# EAGLE design hih8000 (EAGLE 7.6.0)
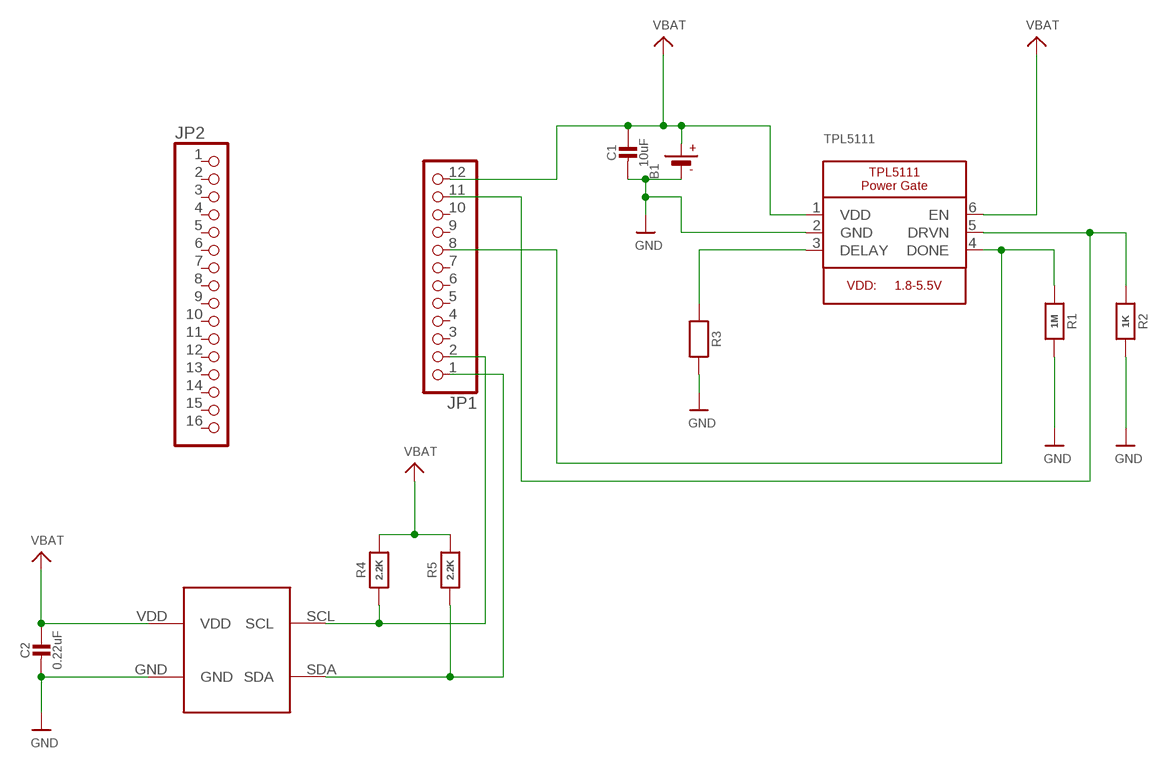
[diagram p0: schematic, sheet 1]

## Parts
B1  BATTERY  [JSTPH2]
C1  10uF  CAP_CERAMIC0805-NOOUTLINE  [0805-NO]
C2  0.22uF  CAP_CERAMIC0805-NOOUTLINE  [0805-NO]
JP1  HEADER-1X12  [1X12_ROUND]
JP2  HEADER-1X16ROUND  [1X16_ROUND]
R1  1M  RESISTOR0805_NOOUTLINE  [0805-NO]
R2  1K  RESISTOR0805_NOOUTLINE  [0805-NO]
R3  RESISTOR0805_NOOUTLINE  [0805-NO]
R4  2.2K  RESISTOR0805_NOOUTLINE  [0805-NO]
R5  2.2K  RESISTOR0805_NOOUTLINE  [0805-NO]
TPL5111  TPL5111  [SOT23-6]
U$7  HIH8000_DEV  [HIH8000]

## Nets
GND: B1.1(-) C1.2 C2.2 R1.2 R2.2 R3.2 TPL5111.2(GND) U$7.GND
N$1: JP1.11 R2.1 TPL5111.5(DRVN)
N$2: JP1.8 R1.1 TPL5111.4(DONE)
N$3: R3.1 TPL5111.3(DELAY)
N$4: JP1.2 R4.1 U$7.SCL
N$5: JP1.1 R5.1 U$7.SDA
VBAT: B1.2(+) C1.1 C2.1 JP1.12 R4.2 R5.2 TPL5111.1(VDD) TPL5111.6(EN) U$7.VDD
Unconnected: JP1.3 JP1.4 JP1.5 JP1.6 JP1.7 JP1.9 JP1.10 JP2.1 JP2.2 JP2.3 JP2.4 JP2.5 JP2.6 JP2.7 JP2.8 JP2.9 JP2.10 JP2.11 JP2.12 JP2.13 JP2.14 JP2.15 JP2.16

## Library data of the parts
B1 = microbuilder:BATTERY: CR1220 SMT - Digikey: 3001K-ND CD2032 BAT-HLD-001 - Digikey: BAT-HLD-001-ND
C1 C2 = microbuilder:CAP_CERAMIC: Ceramic Capacitors For new designs, use the packages preceded by an '_' character since they are more reliable: The following footprints should be used on most boards: _0402 - Standard footprint for regular board layouts _0603 - Standard footprint for regular board layouts _0805 - Standard footprint for regular board layouts _1206 - Standard footprint for regular board layouts For extremely tight-pitch boards where space is at a premium, the following 'micro-pitch' footprints can be used (smaller pads, no silkscreen outline, etc.): _0402MP - Micro-pitch footprint for very dense/compact boards _0603MP - Micro-pitch footprint for very dense/compact boards _0805MP - Micro-pitch footprint for very dense/compact boards _1206MP - Micro-pitch footprint for very dense/compact boards
JP1 = microbuilder:HEADER-1X12
JP2 = microbuilder:HEADER-1X16: PIN HEADER
R1-R5 = microbuilder:RESISTOR: Resistors For new designs, use the packages preceded by an '_' character since they are more reliable: The following footprints should be used on most boards: _0402 - Standard footprint for regular board layouts _0603 - Standard footprint for regular board layouts _0805 - Standard footprint for regular board layouts _1206 - Standard footprint for regular board layouts For extremely tight-pitch boards where space is at a premium, the following 'micro-pitch' footprints can be used (smaller pads, no silkscreen outline, etc.): _0402MP - Micro-pitch footprint for very dense/compact boards _0603MP - Micro-pitch footprint for very dense/compact boards _0805MP - Micro-pitch footprint for very dense/compact boards _1206MP - Micro-pitch footprint for very dense/compact boards
TPL5111 = microbuilder:TPL5111: TPL5111 Timer Based Power Gate Selectable Time Intervals: 100 ms to 7200 s Current Consumption at 2.5 V: 35 nA (typical) Supply Voltage Range: 1.8 V to 5.5 V
U$7 = cvr_HIH8120-021-001:HIH8000_DEV

## Net classes
0 default: width 0.025 mm, drill 0.025 mm, clearance 0.025 mm

## Board
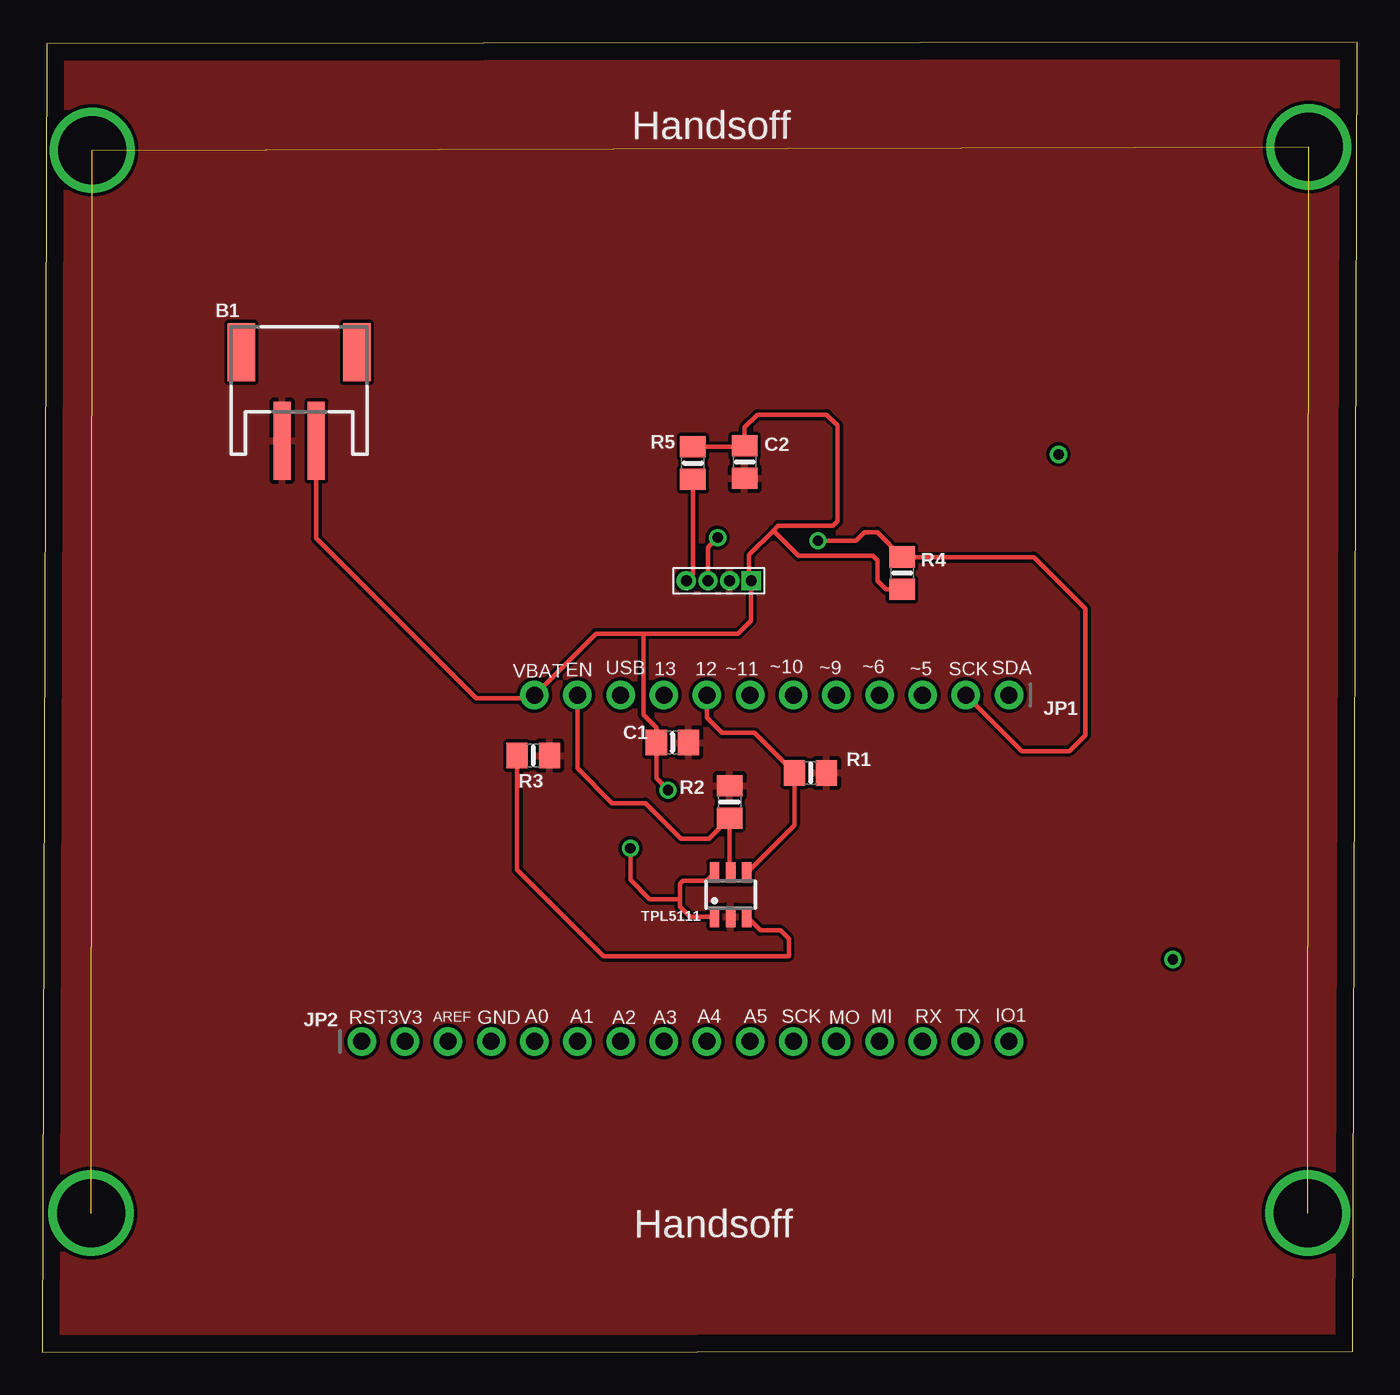
[diagram p1: board, top side]
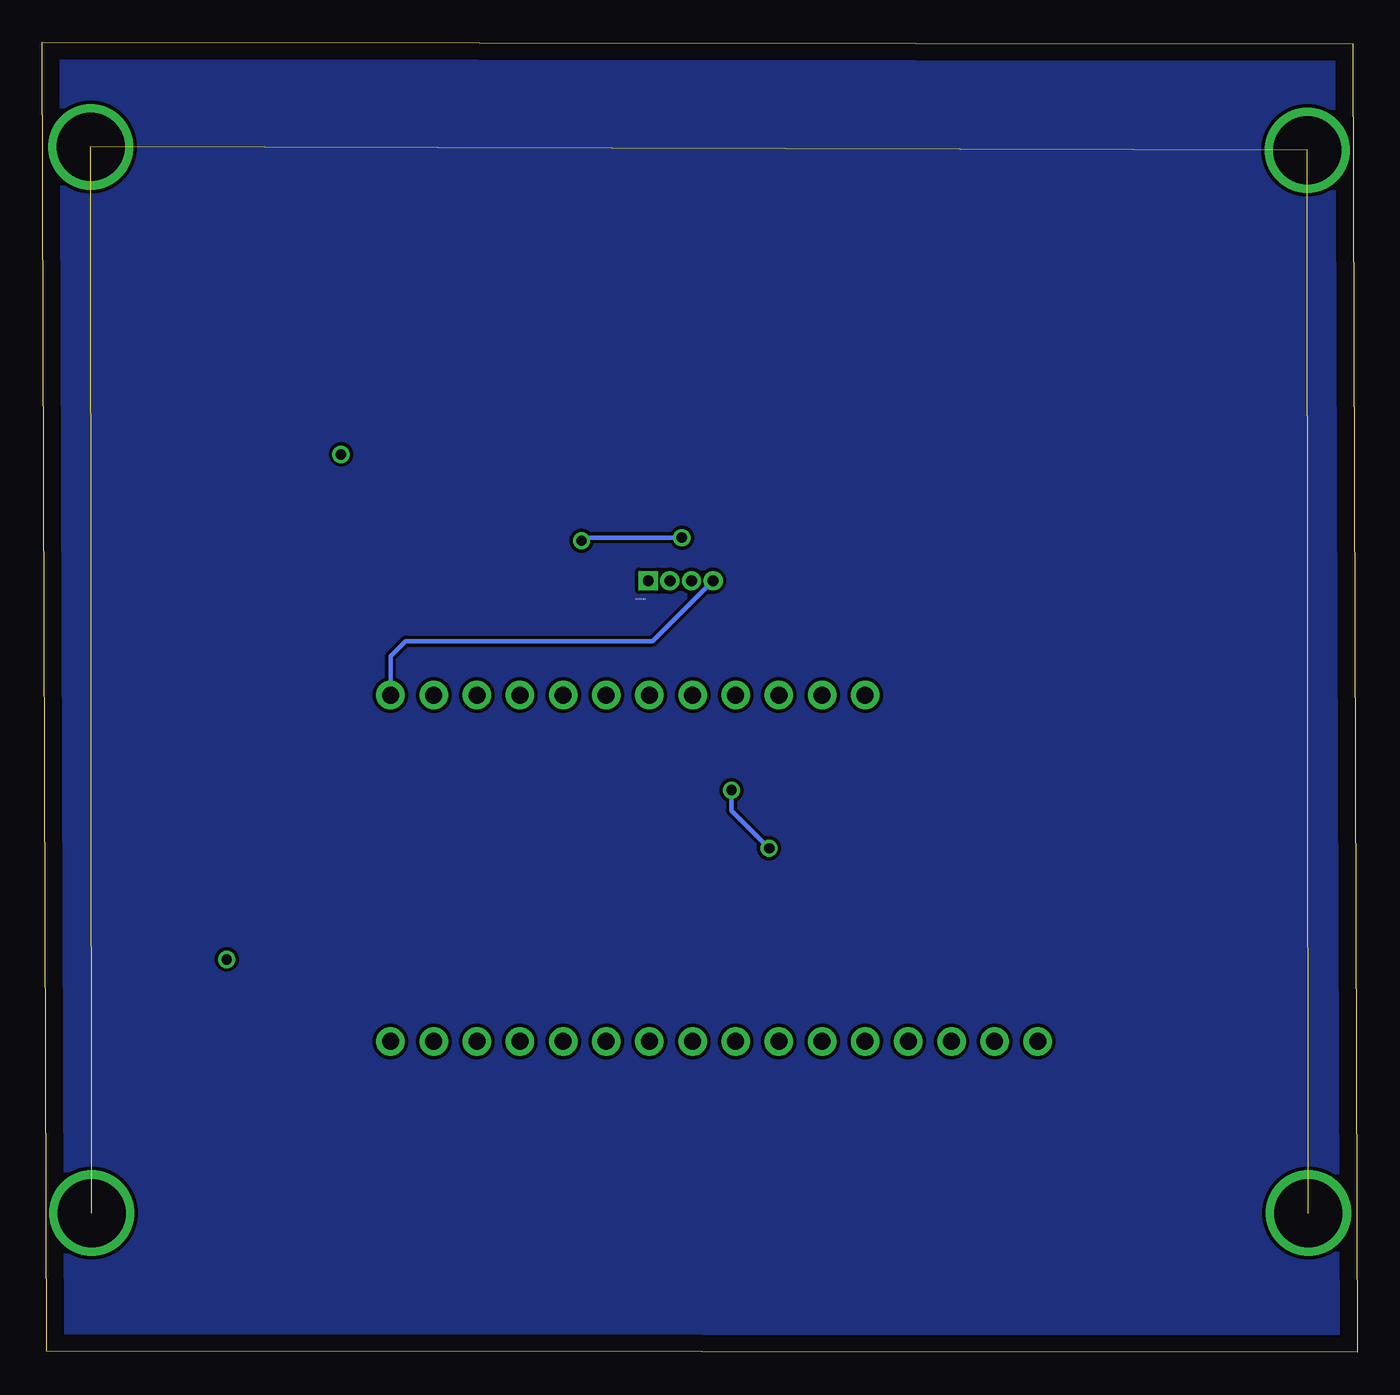
[diagram p2: board, bottom side, seen from below]

Size 77.39 x 77.08 mm. Coordinates in mm from the lower left corner, seen from the top.
Outline: 0,0 77.13,0.06 77.39,77.08 0.25,77.01 0,0
Copper layers (1*16): Top 0.035mm / dielectric 1.5mm / Bottom 0.035mm
Design rules "default": minimum track width 10mil, minimum drill 24mil, track to track 8mil, track to pad 8mil, pad to pad 8mil, via to via 8mil, smd to smd 8mil, copper to edge 40mil, drill to drill 8mil, minimum pad ring 10mil, minimum via ring 8mil, stop-mask expansion 4mil, vias tented up to drill 0mil, thermal gap 10mil

### Footprints (pad centres in the part's own frame; a part is rotated, then mirrored left to right if it is on the bottom)
JSTPH2 = smd 1 x 4.6: 1 -1,-3.7; 2 1,-3.7 | smd 1.6 x 3.4: NC1 -3.4,1.5; NC2 3.4,1.5
0805-NO = smd 1.24 x 1.5: 1 -0.95,0; 2 0.95,0
1X12_ROUND = drill 1 pad 1.676: 1 -13.97,0; 2 -11.43,0; 3 -8.89,0; 4 -6.35,0; 5 -3.81,0; 6 -1.27,0; 7 1.27,0; 8 3.81,0; 9 6.35,0; 10 8.89,0; 11 11.43,0; 12 13.97,0
1X16_ROUND = drill 1 pad 1.676: 1 -19.05,0; 2 -16.51,0; 3 -13.97,0; 4 -11.43,0; 5 -8.89,0; 6 -6.35,0; 7 -3.81,0; 8 -1.27,0; 9 1.27,0; 10 3.81,0; 11 6.35,0; 12 8.89,0; 13 11.43,0; 14 13.97,0; 15 16.51,0; 16 19.05,0
SOT23-6 = smd 0.55 x 1.2: 1 -0.95,-1.3; 2 0,-1.3; 3 0.95,-1.3; 4 0.95,1.3; 5 0,1.3; 6 -0.95,1.3
HIH8000 = drill 0.635 pad 1.016: GND -17.526,0.508; SCL -16.256,0.508; SDA -14.986,0.508 | drill 0.635 pad 1.016 square: VDD -18.796,0.508

### Placement (x,y rotation side)
B1  15.11,57.34 0 top
C1  37.08,35.88 0 top
C2  41.34,52.39 270 top
JP1  42.93,38.67 180 top
JP2  37.85,18.29 0 top
R1  45.21,34.1 0 top
R2  40.45,32.38 90 top
R3  28.89,35.12 0 top
R4  50.61,45.85 270 top
R5  38.29,52.32 90 top
TPL5111  40.51,26.92 0 top
U$7  22.92,45.91 180 top

### Tracks (layer width: path | path; a pad name or v marks a point on that pad's centre or on a via)
GND
  pour Top: 0.19,0 77.22,0 77.22,77.41 0.25,76.9
N$1
  Top 0.254: JP1.11 31.5,34.35 33.53,32.32 35.5,32.32 37.59,30.23 39.24,30.23 R2.1 40.45,28.29 TPL5111.5
N$2
  Top 0.254: TPL5111.4 44.26,31.02 R1.1 41.91,36.45 40.01,36.45 39.12,37.34 JP1.8
N$3
  Top 0.254: R3.1 27.94,28.38 33.02,23.3 43.94,23.3 43.94,24.32 43.43,24.83 42.26,24.83 TPL5111.3
N$4  (via drill 0.6)
  Top 0.254: U$7.SCL 39.18,47.37 v39.75,47.94 | JP1.2 57.66,35.37 60.45,35.37 61.4,36.32 61.4,43.75 58.36,46.8 R4.1 49.15,48.26 48.39,48.26 47.88,47.75 v45.66,47.75
  Bottom 0.254: v39.75,47.94 45.28,47.94 v45.66,47.75
N$5
  Top 0.254: R5.1 38.29,45.78 U$7.SDA
  Bottom 0.254: JP1.1 56.9,40.96 56.01,41.85 41.47,41.85 U$7.SDA
N$6  (via drill 0.6)
  other vias: 66.55,23.11
N$7  (via drill 4 pad 5)  (3 unrouted)
  other vias: 2.92,70.74 2.86,8.19 74.49,8.19 74.55,70.93
N$8  (via drill 0.6)
  other vias: 59.82,52.83
N$9
  pour Bottom: 0.19,76.9 0.19,-0.19 77.28,-0.19 77.28,77.09 0.19,77.09 0.19,76.9
VBAT  (via drill 0.6)
  Top 0.254: B1.2 16.11,47.9 25.53,38.48 28.77,38.48 JP1.12 32.58,42.29 35.31,42.29 | R5.2 41.27,53.27 C2.1 41.34,54.42 42.1,55.18 46.16,55.18 46.8,54.55 46.8,48.9 46.55,48.64 43.31,48.64 43.02,48.35 | 43.02,48.35 41.59,46.93 41.59,45.53 U$7.VDD 41.72,43.05 40.96,42.29 35.31,42.29 | R4.2 49.65,44.9 49.15,45.4 49.15,46.61 48.9,46.86 44.51,46.86 43.02,48.35 | TPL5111.1 38.13,25.62 37.53,26.23 37.53,26.73 | 37.53,26.73 37.53,27.56 37.72,27.75 39.09,27.75 TPL5111.6 | v36.83,33.08 36.13,33.78 C1.1 36.13,36.76 35.37,37.53 35.37,42.23 35.31,42.29 | v34.61,29.65 34.61,27.81 35.75,26.67 37.47,26.67 37.53,26.73
  Bottom 0.254: v36.83,33.08 36.83,31.88 v34.61,29.65

### Text on the board
tPlace: Handsoff | VBAT | USB | 13 | 12 | ~11 | ~10 | ~9 | ~6 | ~5 | SCK | SDA | EN | RST | 3V3 | AREF | GND | A0 | A1 | A2 | A3 | A4 | A5 | SCK | MO | MI | RX | TX | IO1 | Handsoff